# Altium project Stepper.PrjPcb
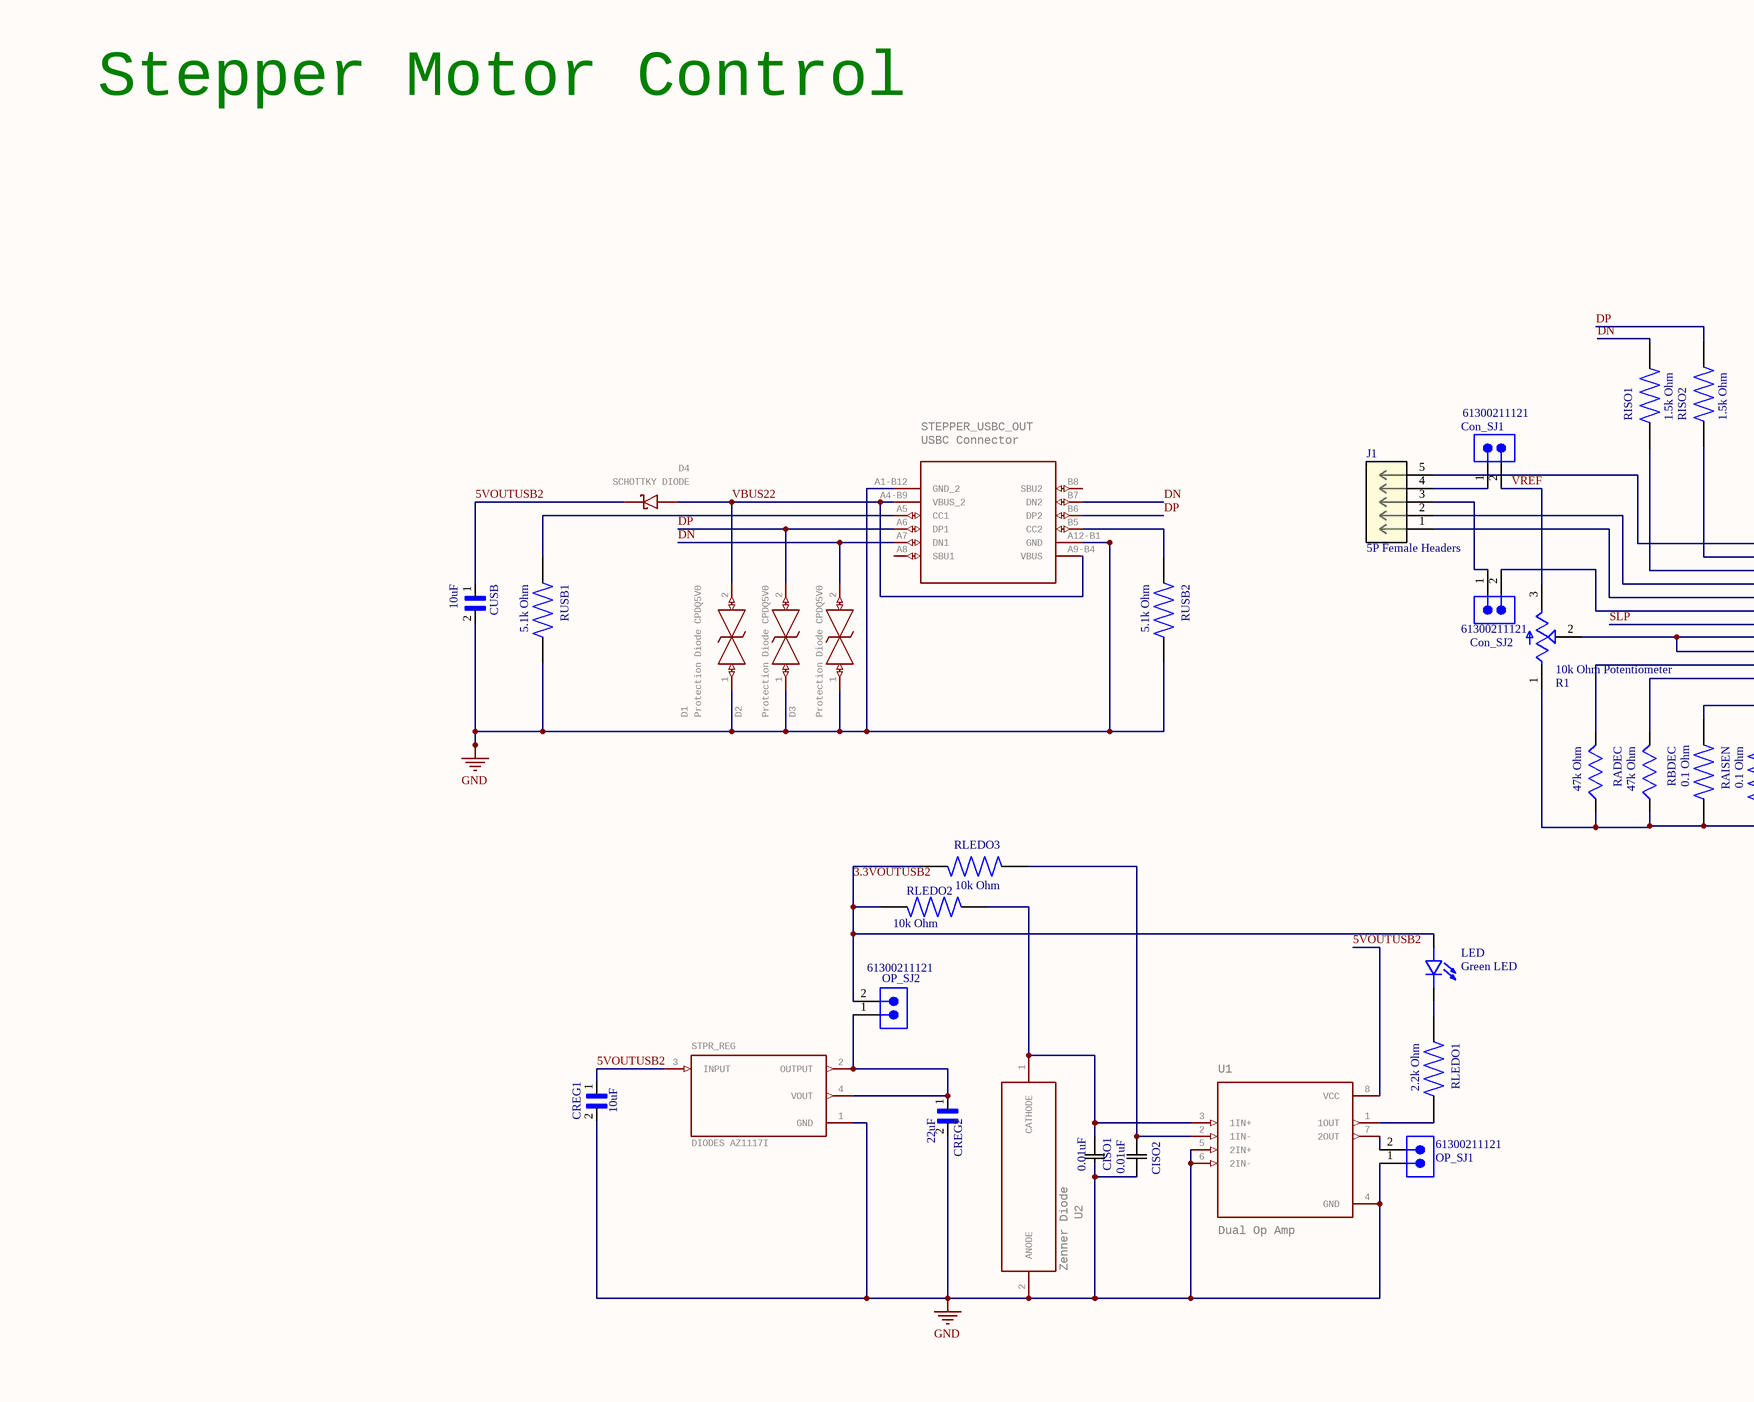
[diagram p0: Stepper.SchDoc, left]
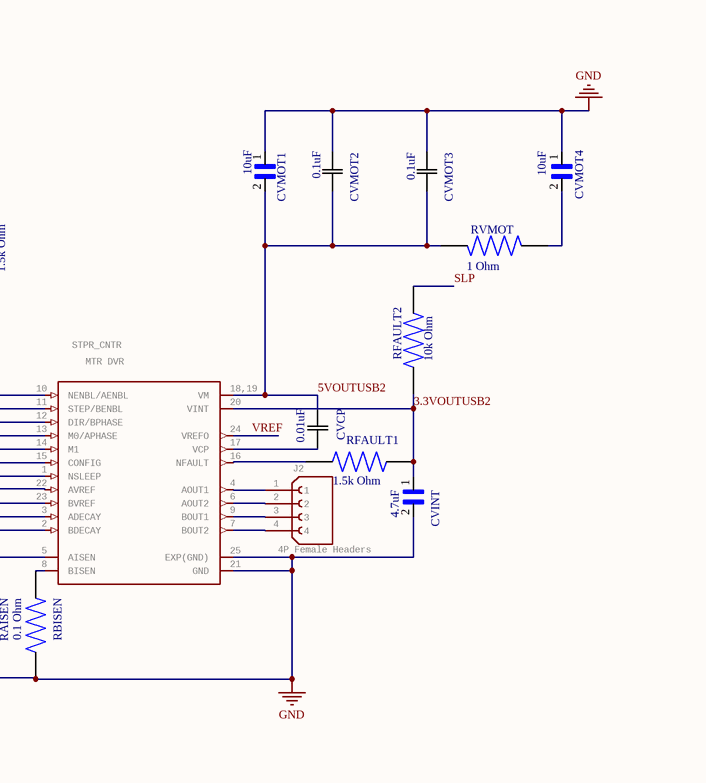
[diagram p1: Stepper.SchDoc, right]
1 sheet, 42 parts. Net scope: global (net labels, ports and power ports of the same name join across sheets).
Board file: Stepper.PcbDoc

## Sheet Stepper.SchDoc
size 586 x 332 mm; Origin: Eagle

### Parts
CISO1  0.01uF  [CAPC220145_88N_KEM]
CISO2  0.01uF  [CAPC220145_88N_KEM]
Con_SJ1  61300211121  [61300211121]
Con_SJ2  61300211121  [61300211121]
CREG1  10uF  [CAPC2012X88N]
CREG2  22uF  [CAPC2012X145N]
CUSB  10uF  [CAPC2012X88N]
CVCP  0.01uF  [CAPC220145_88N_KEM]
CVINT  4.7uF  [CAPC2012X140N]
CVMOT1  10uF  [CAPC2012X88N]
CVMOT2  0.1uF  [CAP_KGM21_KAV]
CVMOT3  0.1uF  [CAP_KGM21_KAV]
CVMOT4  10uF  [CAPC2012X88N]
D1  Protection Diode CPDQ5V0  [MBTB-D-SOD-923F-IMP-0402]
D2  Protection Diode CPDQ5V0  [MBTB-D-SOD-923F-IMP-0402]
D3  Protection Diode CPDQ5V0  [MBTB-D-SOD-923F-IMP-0402]
D4  SCHOTTKY DIODE  [SOD3715X145N]
J1  5P Female Headers  [CONN5_1LFBN-RC_SUL]
J2  4P Female Headers  [SULLINS_PPTC041LFBN-RC]
LED  Green LED  [LEDC1608X35N]
OP_SJ1  61300211121  [61300211121]
OP_SJ2  61300211121  [61300211121]
R1  10k Ohm Potentiometer  [TRIM_TC33X-2-103E]
RADEC  47k Ohm  [RESC2012X60N]
RAISEN  0.1 Ohm  [RESC2012X60N]
RBDEC  47k Ohm  [RESC2012X60N]
RBISEN  0.1 Ohm  [RESC2012X60N]
RFAULT1  1.5k Ohm  [RESC2012X60N]
RFAULT2  10k Ohm  [RESC2012X55N]
RISO1  1.5k Ohm  [RESC2012X60N]
RISO2  1.5k Ohm  [RESC2012X60N]
RLEDO1  2.2k Ohm  [RESC2012X60N]
RLEDO2  10k Ohm  [RESC2012X55N]
RLEDO3  10k Ohm  [RESC2012X55N]
RUSB1  5.1k Ohm  [RESC2012X60N]
RUSB2  5.1k Ohm  [RESC2012X60N]
RVMOT  1 Ohm  [RESC2012X60N]
STEPPER_USBC_OUT  USBC Connector  [USB4110-GF-A_GCT]
STPR_CNTR  MTR DVR  [SOP65P640X120-25N]
STPR_REG  DIODES AZ1117I  [SOT230P700X185-4N]
U1  Dual Op Amp  [SOIC127P599X175-8N]
U2  Zenner Diode  [SOD-123_ONS]

### Nets
GND: CISO1.2 CISO2.2 CREG1.2 CREG2.2 CUSB.2 CVINT.2 CVMOT1.1 CVMOT2.1 CVMOT3.1 CVMOT4.1 D1.1(K) D2.1(K) D3.1(K) OP_SJ1.1 R1.1(CCW) RADEC.2 RAISEN.2 RBDEC.2 RBISEN.2 RUSB1.2 RUSB2.2 STEPPER_USBC_OUT.A1-B12(GND_2) STEPPER_USBC_OUT.A12-B1(GND) STPR_CNTR.21(GND) STPR_CNTR.25(EXP(GND)) STPR_REG.1(GND) U1.4(GND) U1.5(2IN+) U1.6(2IN-) U2.2(ANODE)
3.3VOUTUSB2: CVINT.1 LED.A OP_SJ2.2 RFAULT1.2 RFAULT2.1 RLEDO2.2 RLEDO3.2 STPR_CNTR.20(VINT)
5VOUTUSB2: CREG1.1 CUSB.1 CVCP.1 CVMOT1.2 CVMOT2.2 CVMOT3.2 D4.C(K) RVMOT.2 STPR_CNTR.18,19(VM) STPR_REG.3(INPUT) U1.8(VCC)
DN: D3.2(A) RISO1.2 STEPPER_USBC_OUT.A7(DN1) STEPPER_USBC_OUT.B7(DN2)
DP: D2.2(A) RISO2.2 STEPPER_USBC_OUT.A6(DP1) STEPPER_USBC_OUT.B6(DP2)
SLP: RFAULT2.2 STPR_CNTR.1(NSLEEP)
VBUS22: D1.2(A) D4.A STEPPER_USBC_OUT.A4-B9(VBUS_2) STEPPER_USBC_OUT.A9-B4(VBUS)
VREF: Con_SJ1.2 R1.3(CW) STPR_CNTR.24(VREFO)
NetCISO1_1: CISO1.1 RLEDO2.1 U1.3(1IN+) U2.1(CATHODE)
NetCISO2_1: CISO2.1 RLEDO3.1 U1.2(1IN-)
NetCon_SJ1_1: Con_SJ1.1 J1.4
NetCon_SJ2_1: Con_SJ2.1 J1.3
NetCon_SJ2_2: Con_SJ2.2 STPR_CNTR.15(CONFIG)
NetCREG2_1: CREG2.1 OP_SJ2.1 STPR_REG.2(OUTPUT) STPR_REG.4(VOUT)
NetCVCP_2: CVCP.2 STPR_CNTR.17(VCP)
NetCVMOT4_2: CVMOT4.2 RVMOT.1
NetJ1_1: J1.1 STPR_CNTR.14(M1)
NetJ1_2: J1.2 STPR_CNTR.13(M0/APHASE)
NetJ1_5: J1.5 STPR_CNTR.10(NENBL/AENBL)
NetJ2_1: J2.1 STPR_CNTR.4(AOUT1)
NetJ2_2: J2.2 STPR_CNTR.6(AOUT2)
NetJ2_3: J2.3 STPR_CNTR.9(BOUT1)
NetJ2_4: J2.4 STPR_CNTR.7(BOUT2)
NetLED_C: LED.C RLEDO1.1
NetOP_SJ1_2: OP_SJ1.2 U1.7(2OUT)
NetR1_2: R1.2(W) STPR_CNTR.22(AVREF) STPR_CNTR.23(BVREF)
NetRADEC_1: RADEC.1 STPR_CNTR.3(ADECAY)
NetRAISEN_1: RAISEN.1 STPR_CNTR.5(AISEN)
NetRBDEC_1: RBDEC.1 STPR_CNTR.2(BDECAY)
NetRBISEN_1: RBISEN.1 STPR_CNTR.8(BISEN)
NetRFAULT1_1: RFAULT1.1 STPR_CNTR.16(NFAULT)
NetRISO1_1: RISO1.1 STPR_CNTR.12(DIR/BPHASE)
NetRISO2_1: RISO2.1 STPR_CNTR.11(STEP/BENBL)
NetRLEDO1_2: RLEDO1.2 U1.1(1OUT)
NetRUSB1_1: RUSB1.1 STEPPER_USBC_OUT.A5(CC1)
NetRUSB2_1: RUSB2.1 STEPPER_USBC_OUT.B5(CC2)

Not connected (* = marked no-connect by the designer): STEPPER_USBC_OUT A8(SBU1) B8(SBU2)

### Notes on the sheet
- Stepper Motor Control

### Library data of the parts
CISO1 CISO2 CVCP = C0805C103K1RAC7210: CAP CER SMD 0805 .01UF 100V X7R; Mfr_Name: Kemet; Copyright: Copyright (C) 2023 Ultra Librarian. All rights reserved.; Manufacturer_Part_Number: C0805C103K1RAC7210; RefDes: RefDes; Type: DEV
Con_SJ1 Con_SJ2 OP_SJ1 OP_SJ2 = CMP-1712-00002-5: CONN HEADER VERT 2POS 2.54MM; NexarPartId: 20081794; Operating Supply Voltage: 250V; Current Rating: 3A; Gender: Male; Number of Contacts: 2; Connector Type: Male Pin; Contact Resistance: 20mΩ; Contact Plating: Gold; Contact Material: Copper; Number of Pins: 2; Min Operating Temperature: -40°C; Packaging: Bulk; Lead Pitch: 2.54mm; Mount: Through Hole; Orientation: Vertical; RoHS: Compliant; Pitch: 2.54mm; REACH SVHC: No SVHC; Height: 8.94mm; Termination: Through Hole; Number of Positions: 2; Contact Mating Length: 5.9944mm; Color: Black; Contact Gender: Male; Number of Rows: 1; Housing Material: PBT; Lead Free: Lead Free; Voltage Rating: 250V; Max Operating Temperature: 125°C
CREG1 CUSB CVMOT1 CVMOT4 = C0805C106J8RACAUTO: CAP CER 10UF 10V X7R 0805; MF: KEMET; Price: None; SnapEDA_Link: https://www.snapeda.com/parts/C0805C106J8RACAUTO/KEMET/view-part/3596814/?ref=snap; MP: C0805C106J8RACAUTO; Availability: Unavailable; Value: *; Package: 0805 KEMET
CREG2 = GRM21BR61C226ME44L: CAP CER 22UF 16V X5R 0805; MF: Murata; Arrow_Electronics-Purchase-URL: https://snapeda.com/shop?store=Arrow+Electronics&id=4387753; Value: *; Package: 2012 Murata; MP: GRM21BR61C226ME44L; DigiKey-Purchase-URL: https://snapeda.com/shop?store=DigiKey&id=4387753; Mouser-Purchase-URL: https://snapeda.com/shop?store=Mouser&id=4387753; SnapEDA_Link: https://www.snapeda.com/parts/GRM21BR61C226ME44L/Murata/view-part/4387753/?ref=snap; Digi-Key_Part_Number: 490-10747-1-ND
CVINT = C0805C475M4RACAUTO: CAP CER 4.7UF 16V X7R 0805; Package: None; Price: None; Value: *; MP: C0805C475M4RACAUTO; Availability: Unavailable
CVMOT2 CVMOT3 = KGM21NR71H104JT: CAP CER 0.1UF 50V X7R 0805; Mfr_Name: KYOCERA AVX; Type: DEV; Copyright: Copyright (C) 2023 Ultra Librarian. All rights reserved.; Manufacturer_Part_Number: KGM21NR71H104JT; RefDes: RefDes
D1-D3 = CPDQ5V0-HF: TVS DIODE 5VWM 18.6V 0402/SOD923; GateName_1: G$1; MF: Comchip Technology; SymbolName_1: CPDQ5V0-HF; LibraryName: CPDQ5V0-HF; DeviceSetName: CPDQ5V0-HF; AVAILABILITY: In Stock; CHECK_PRICES: https://www.snapeda.com/parts/CPDQ5V0-HF/Comchip+Technology/view-part/?ref=eda; MP: CPDQ5V0-HF; PACKAGE: 0402 Comchip; PRICE: None; PURCHASE-URL: https://www.snapeda.com/api/url_track_click_mouser/?unipart_id=809934&manufacturer=Comchip Technology&part_name=CPDQ5V0-HF&search_term=cpdq5v0-hf; SNAPEDA_LINK: https://www.snapeda.com/parts/CPDQ5V0-HF/Comchip+Technology/view-part/?ref=snap
D4 = 1N5819HW-7-F: DIODE SCHOTTKY 40V 1A SOD123; GateName_1: G$1; MF: Diodes Inc.; SymbolName_1: 1N5819HW-7-F; LibraryName: 1N5819HW-7-F; DeviceSetName: 1N5819HW-7-F; Availability: In Stock; Check_prices: https://www.snapeda.com/parts/1N5819HW-7-F/Diodes+Inc./view-part/?ref=eda; MP: 1N5819HW-7-F; Package: SOD-123 Fairchild Semiconductor; Price: None; Purchase-URL: https://www.snapeda.com/api/url_track_click_mouser/?unipart_id=42272&manufacturer=Diodes Inc.&part_name=1N5819HW-7-F&search_term=1n5819hw-7-f; SnapEDA_Link: https://www.snapeda.com/parts/1N5819HW-7-F/Diodes+Inc./view-part/?ref=snap
J1 = PPTC051LFBN-RC: CONN HDR 5POS 0.1 TIN PCB; Mfr_Name: Sullins; Copyright: Copyright (C) 2023 Ultra Librarian. All rights reserved.; Manufacturer_Part_Number: PPTC051LFBN-RC; RefDes: RefDes; Type: DEV
J2 = PPTC041LFBN-RC: CONN HDR 4POS 0.1 TIN PCB; GateName_1: G$1; MF: Sullins Connector; SymbolName_1: PPTC041LFBN-RC; LibraryName: PPTC041LFBN-RC; DeviceSetName: PPTC041LFBN-RC; Package: SULLINS_PPTC041LFBN-RC; Package: None; Price: None; Check_prices: https://www.snapeda.com/parts/PPTC041LFBN-RC/Sullins+Connector+Solutions/view-part/?ref=eda; SnapEDA_Link: https://www.snapeda.com/parts/PPTC041LFBN-RC/Sullins+Connector+Solutions/view-part/?ref=snap; MP: PPTC041LFBN-RC; Availability: In Stock; Purchase-URL: https://www.snapeda.com/api/url_track_click_mouser/?unipart_id=285917&manufacturer=Sullins Connector&part_name=PPTC041LFBN-RC&search_term=pptc041lfbn-rc
LED = LTST-C190GKT: LED GREEN CLEAR CHIP SMD; MF: Lite-On Inc.; SnapEDA_Link: https://www.snapeda.com/parts/LTST-C190GKT/Lite-On+Inc./view-part/?ref=snap; Package: 0603 Lite-On; Value: *; MP: LTST-C190GKT; Check_prices: https://www.snapeda.com/parts/LTST-C190GKT/Lite-On+Inc./view-part/?ref=eda
R1 = TC33X-2-103E: TRIMMER 10K OHM 0.1W J LEAD TOP; MF: Bourns; MP: TC33X-2-103E; SnapEDA_Link: https://www.snapeda.com/parts/TC33X-2-103E/Bourns/view-part/47092/?ref=snap; Package: SOD-23 Bourns; Check_prices: https://www.snapeda.com/parts/TC33X-2-103E/Bourns/view-part/47092/?ref=eda; Value: *; Purchase-URL: https://pricing.snapeda.com/search/part/TC33X-2-103E/?ref=eda; Digi-Key_Part_Number: TC33X-103ECT-ND
RADEC RBDEC = RC0805FR-1047KL: RES 47K OHM 1% 1/8W 0805; Price: None; Availability: Unavailable; Value: *; MP: RC0805FR-1047KL; Package: None
RAISEN RBISEN = CRM0805AFX-R100ELF: RES 0.1 OHM 1% 1/4W 0805; Package: None; Price: None; Value: *; MP: CRM0805AFX-R100ELF; Availability: Unavailable
RFAULT1 RISO1 RISO2 = AC0805JR-071K5L: RES SMD 1.5K OHM 5% 1/8W 0805; Package: None; Price: None; Value: *; MP: AC0805JR-071K5L; Availability: Unavailable
RFAULT2 RLEDO2 RLEDO3 = TNPW080510K0FEEA: RES 10K OHM 1% 1/8W 0805; Package: None; Price: None; Value: *; MP: TNPW080510K0FEEA; Availability: Unavailable
RLEDO1 = AC0805FR-072K2L: RES SMD 2.2K OHM 1% 1/8W 0805; Package: None; Price: None; Value: *; MP: AC0805FR-072K2L; Availability: Unavailable
RUSB1 RUSB2 = RC0805JR-075K1L: RES 5.1K OHM 5% 1/8W 0805; Package: None; Price: None; Value: *; MP: RC0805JR-075K1L; Availability: Unavailable
RVMOT = RC0805JR-071RL: RES 1 OHM 5% 1/8W 0805; MF: Yageo; Purchase-URL: https://pricing.snapeda.com/search/part/RC0805JR-071RL/?ref=eda; Package: 2012 Rohm Semiconductor; Check_prices: https://www.snapeda.com/parts/RC0805JR-071RL/Yageo/view-part/615240/?ref=eda; Digi-Key_Part_Number: 311-1.0ARCT-ND; Value: *; MP: RC0805JR-071RL; SnapEDA_Link: https://www.snapeda.com/parts/RC0805JR-071RL/Yageo/view-part/615240/?ref=snap
STEPPER_USBC_OUT = USB4110-GF-A: CONN RCP USB2.0 TYP C 24P SMD RA; MFR_NAME: Global Connector Technology; GateName_1: A; SymbolName_1: USB4110-GF-A; LibraryName: USB4110-GF-A; DeviceSetName: USB4110-GF-A; COPYRIGHT: Copyright (C) 2023 Ultra Librarian. All rights reserved.; MANUFACTURER_PART_NUMBER: USB4110-GF-A
STPR_CNTR = DRV8834PWP: IC MOTOR DRIVER BIPOLAR 24HTSSOP; GateName_1: G$1; MF: Texas Instruments; SymbolName_1: DRV8834PWP; LibraryName: DRV8834PWP; DeviceSetName: DRV8834PWP; AVAILABILITY: In Stock; MP: DRV8834PWP; PACKAGE: HTSSOP-24 Texas Instruments; PRICE: None; PURCHASE-URL: https://pricing.snapeda.com/search?q=DRV8834PWP&ref=eda
STPR_REG = AZ1117IH-3.3TRG1: IC REG LINEAR 3.3V 1A SOT223; GateName_1: G$1; MF: Diodes Inc.; SymbolName_1: AZ1117IH-3.3TRG1; LibraryName: AZ1117IH-3.3TRG1; DeviceSetName: AZ1117IH-3.3TRG1; AVAILABILITY: In Stock; CHECK_PRICES: https://www.snapeda.com/parts/AZ1117IH-3.3TRG1/Diodes+Inc./view-part/?ref=eda; MP: AZ1117IH-3.3TRG1; PACKAGE: SOT-223 Diodes Inc.; PRICE: None; PURCHASE-URL: https://www.snapeda.com/api/url_track_click_mouser/?unipart_id=490259&manufacturer=Diodes Inc.&part_name=AZ1117IH-3.3TRG1&search_term=az1117ih-3.3trg1; SNAPEDA_LINK: https://www.snapeda.com/parts/AZ1117IH-3.3TRG1/Diodes+Inc./view-part/?ref=snap
U1 = LM358DR: IC OPAMP GP 2 CIRCUIT 8SOIC; GateName_1: A; MF: Texas Instruments; SymbolName_1: LM358DR; LibraryName: LM358DR; DeviceSetName: LM358DR; AVAILABILITY: In Stock; CHECK_PRICES: https://www.snapeda.com/parts/LM358DR/Texas+Instruments/view-part/?ref=eda; MP: LM358DR; PACKAGE: SOIC-8 Texas Instruments; PRICE: None; PURCHASE-URL: https://www.snapeda.com/api/url_track_click_mouser/?unipart_id=6639&manufacturer=Texas Instruments&part_name=LM358DR&search_term=lm358dr; SNAPEDA_LINK: https://www.snapeda.com/parts/LM358DR/Texas+Instruments/view-part/?ref=snap
U2 = MMSZ5225BT1G: DIODE ZENER 3V 500MW SOD123; MFR_NAME: onsemi; GateName_1: A; SymbolName_1: MMSZ5225BT1G; LibraryName: MMSZ5225BT1G; DeviceSetName: MMSZ5225BT1G; COPYRIGHT: Copyright (C) 2023 Ultra Librarian. All rights reserved.; MANUFACTURER_PART_NUMBER: MMSZ5225BT1G